# Altium schematic sheet CSM32RV20_QFN_3V5V_V1.1.SchDoc
size 270 x 163 mm
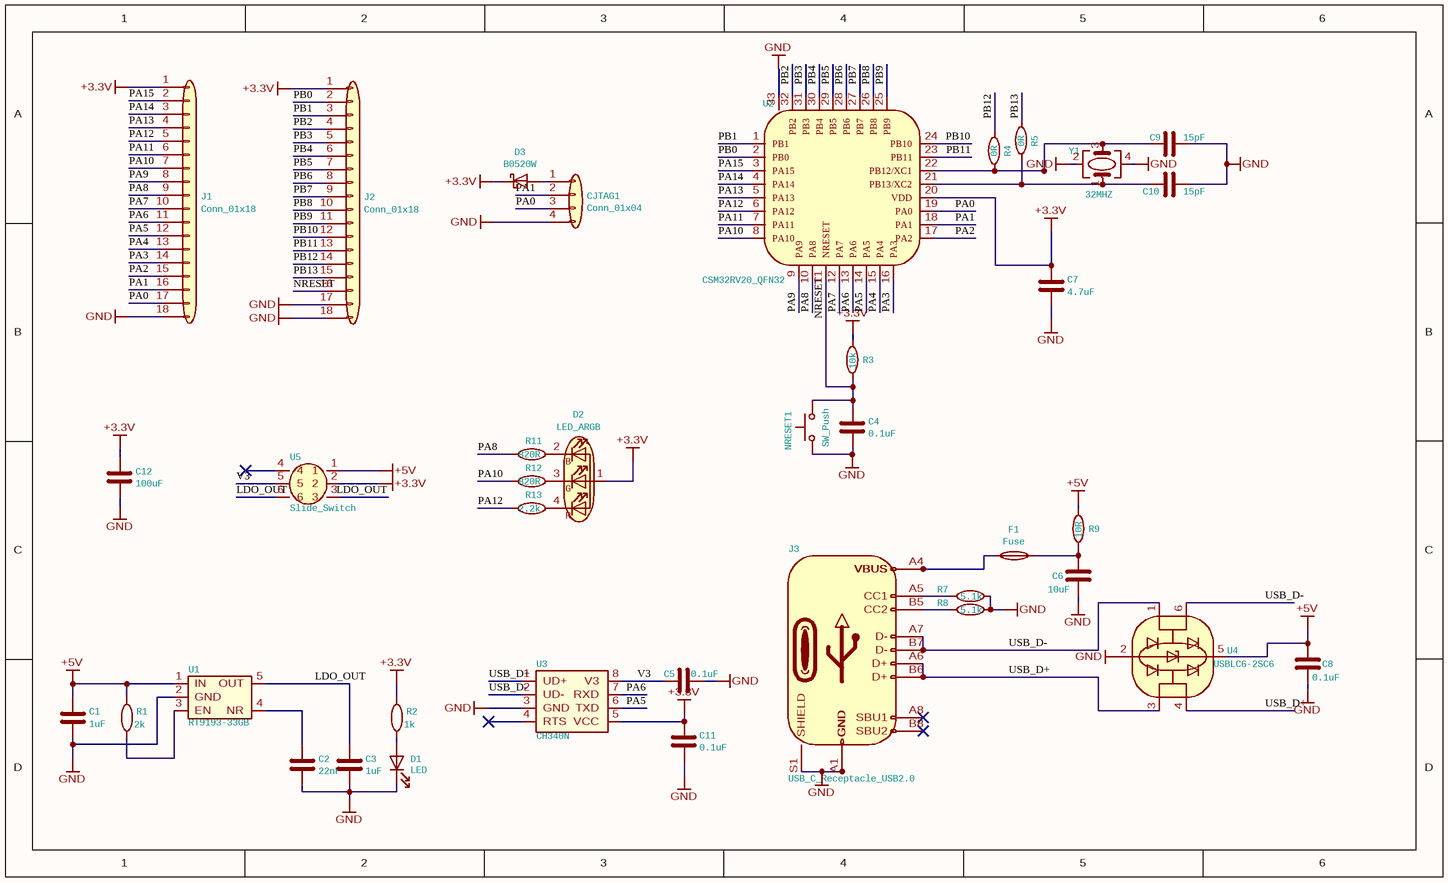
[diagram p0: CSM32RV20_QFN_3V5V_V1.1.SchDoc]

## Parts
C1  1uF  [0402]
C2  22nF  [0402]
C3  1uF  [0402]
C4  0.1uF  [0402]
C5  0.1uF  [0402]
C6  10uF  [0402]
C7  4.7uF  [0402]
C8  0.1uF  [0402]
C9  15pF  [0402]
C10  15pF  [0402]
C11  0.1uF  [0402]
C12  100uF  [C1210]
CJTAG1  Conn_01x04  [PINHEADER_1X04_P2.54MM_VERTICAL]
D1  LED  [LED 0402]
D2  LED_ARGB  [LED_RGB_1210]
D3  B0520W  [D_SOD-123]
F1  Fuse  [FUSE_0805_2012METRIC]
J1  Conn_01x18  [PINHEADER_1X18_P2.54MM_VERTICAL]
J2  Conn_01x18  [PINHEADER_1X18_P2.54MM_VERTICAL]
J3  USB_C_Receptacle_USB2.0  [USB-C-SMD_KH-TYPE-C-16P]
NRESET1  SW_Push  [SW_PUSH_SPST_NO_ALPS_SKRK]
R1  2k  [0402]
R2  1k  [0402]
R3  10k  [0402]
R4  0R  [0402]
R5  0R  [0402]
R7  5.1k  [0402]
R8  5.1k  [0402]
R9  10R  [0402]
R11  820R  [0402]
R12  820R  [0402]
R13  2.2k  [0402]
U1  RT9193-33GB  [SOT-23-5]
U2  CSM32RV20_QFN32  [QFN-32-1EP_4X4MM_P0.4MM_EP2.65X2.65MM_THERMALVIAS]
U3  CH340N  [SOP-8-1EP_6X5MM_P1.27MM]
U4  USBLC6-2SC6  [SOT-23-6]
U5  Slide_Switch  [SLIDE_SWITCH_SMD]
Y1  32MHZ  [CRYSTAL_SMD_ABRACON_ABM8G-4PIN_3.2X2.5MM]

## Nets
+3.3V: C7.1 C11.1 C12.1 D2.1(A) D3.1(K) J1.1(Pin_1) J2.1(Pin_1) R2.1 R3.1 U2.20(VDD) U3.5(VCC) U5.2
+5V: C1.1 C8.2 R1.1 R9.1 U1.1(IN) U4.5(VBUS) U5.1
GND: C1.2 C2.2 C3.2 C4.2 C5.1 C6.1 C7.2 C8.1 C9.1 C10.1 C11.2 C12.2 CJTAG1.4(Pin_4) D1.2(K) J1.18(Pin_18) J2.17(Pin_17) J2.18(Pin_18) J3.A1(GND) J3.A12(GND) J3.B1(GND) J3.B12(GND) J3.S1(SHIELD) NRESET1.1 R7.2 R8.2 U1.2(GND) U2.33(GND) U3.3(GND) U4.2(GND) Y1.2 Y1.4
LDO_OUT: C3.1 U1.5(OUT) U5.3 U5.6
NRESET: C4.1 J2.16(Pin_16) NRESET1.2 R3.2 U2.11(NRESET)
PA0: CJTAG1.3(Pin_3) J1.17(Pin_17) U2.19(PA0)
PA1: CJTAG1.2(Pin_2) J1.16(Pin_16) U2.18(PA1)
PA2: J1.15(Pin_15) U2.17(PA2)
PA3: J1.14(Pin_14) U2.16(PA3)
PA4: J1.13(Pin_13) U2.15(PA4)
PA5: J1.12(Pin_12) U2.14(PA5) U3.6(TXD)
PA6: J1.11(Pin_11) U2.13(PA6) U3.7(RXD)
PA7: J1.10(Pin_10) U2.12(PA7)
PA8: J1.9(Pin_9) R11.2 U2.10(PA8)
PA9: J1.8(Pin_8) U2.9(PA9)
PA10: J1.7(Pin_7) R12.2 U2.8(PA10)
PA11: J1.6(Pin_6) U2.7(PA11)
PA12: J1.5(Pin_5) R13.2 U2.6(PA12)
PA13: J1.4(Pin_4) U2.5(PA13)
PA14: J1.3(Pin_3) U2.4(PA14)
PA15: J1.2(Pin_2) U2.3(PA15)
PB0: J2.2(Pin_2) U2.2(PB0)
PB1: J2.3(Pin_3) U2.1(PB1)
PB2: J2.4(Pin_4) U2.32(PB2)
PB3: J2.5(Pin_5) U2.31(PB3)
PB4: J2.6(Pin_6) U2.30(PB4)
PB5: J2.7(Pin_7) U2.29(PB5)
PB6: J2.8(Pin_8) U2.28(PB6)
PB7: J2.9(Pin_9) U2.27(PB7)
PB8: J2.10(Pin_10) U2.26(PB8)
PB9: J2.11(Pin_11) U2.25(PB9)
PB10: J2.12(Pin_12) U2.24(PB10)
PB11: J2.13(Pin_13) U2.23(PB11)
PB12: J2.14(Pin_14) R4.1
PB13: J2.15(Pin_15) R5.1
USB_D+: J3.A6(D+) J3.B6(D+) U3.1(UD+) U4.3(I/O2) U4.4(I/O2)
USB_D-: J3.A7(D-) J3.B7(D-) U3.2(UD-) U4.1(I/O1) U4.6(I/O1)
V3: C5.2 U3.8(V3) U5.5
NetC2_1: C2.1 U1.4(NR)
NetC6_2: C6.2 F1.1 R9.2
NetC9_2: C9.2 R4.2 U2.22(PB12/XC1) Y1.3
NetC10_2: C10.2 R5.2 U2.21(PB13/XC2) Y1.1
NetCJTAG1_1: CJTAG1.1(Pin_1) D3.2(A)
NetD1_1: D1.1(A) R2.2
NetD2_2: D2.2(RK) R11.1
NetD2_3: D2.3(GK) R12.1
NetD2_4: D2.4(BK) R13.1
NetF1_2: F1.2 J3.A4(VBUS) J3.A9(VBUS) J3.B4(VBUS) J3.B9(VBUS)
NetJ3_A5: J3.A5(CC1) R7.1
NetJ3_B5: J3.B5(CC2) R8.1
NetR1_2: R1.2 U1.3(EN)

Not connected (* = marked no-connect by the designer): J3 A8(SBU1)* B8(SBU2)*; U3 4(RTS)*; U5 4*

## Notes on the sheet
- (in symbol LED_ARGB) B; G; R

## Library data of the parts
C7 = 0.1uF
D3 = B0520W: Datasheet: http://www.jameco.com/Jameco/Products/ProdDS/1538777.pdf
J3 = USB_C_Receptacle_USB2.0: Datasheet: https://www.usb.org/sites/default/files/documents/usb_type-c.zip
U4 = USBLC6-2SC6: Datasheet: https://www.st.com/resource/en/datasheet/usblc6-2.pdf